# EAGLE design 555timers_with_allmodes (EAGLE 9.6.2)
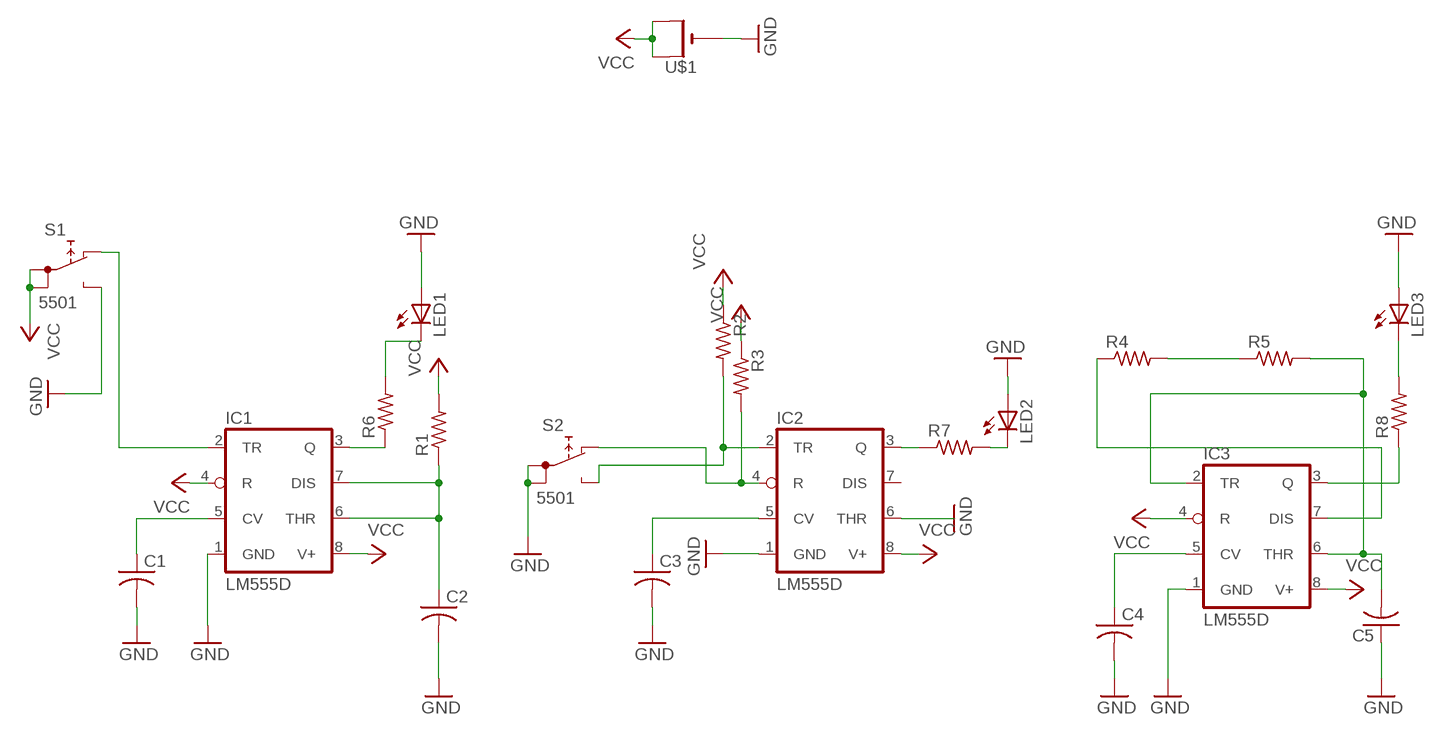
[diagram p0: schematic, sheet 1]

## Parts
C1  C-USC0805  [C0805]
C2  C-USC0805  [C0805]
C3  C-USC0805  [C0805]
C4  C-USC0805  [C0805]
C5  C-USC0805  [C0805]
IC1  LM555D  [SO08]
IC2  LM555D  [SO08]
IC3  LM555D  [SO08]
LED1  LEDCHIPLED_0805  [CHIPLED_0805]
LED2  LEDCHIPLED_0805  [CHIPLED_0805]
LED3  LEDCHIPLED_0805  [CHIPLED_0805]
R1  R-US_FLIPFLOP  [0805-THM]
R2  R-US_FLIPFLOP  [0805-THM]
R3  R-US_FLIPFLOP  [0805-THM]
R4  R-US_FLIPFLOP  [0805-THM]
R5  R-US_FLIPFLOP  [0805-THM]
R6  R-US_FLIPFLOP  [0805-THM]
R7  R-US_FLIPFLOP  [0805-THM]
R8  R-US_FLIPFLOP  [0805-THM]
S1  5501  [5501]
S2  5501  [5501]
U$1  CR1220SMT  [CR1220-SMD]

## Nets
GND: C1.2 C2.2 C3.2 C4.2 C5.1 IC1.1(GND) IC2.1(GND) IC2.6(THR) IC3.1(GND) LED1.A LED2.A LED3.A S1.NO S2.1A S2.1B U$1.-
N$1: C1.1 IC1.5(CV)
N$2: IC2.2(TR) R2.2 S2.NO
N$3: C2.1 IC1.6(THR) IC1.7(DIS) R1.1
N$5: IC1.2(TR) S1.NC
N$6: LED1.C R6.2
N$7: C3.1 IC2.5(CV)
N$8: IC2.4(R) R3.2 S2.NC
N$9: C4.1 IC3.5(CV)
N$11: IC2.3(Q) R7.1
N$13: C5.2 IC3.2(TR) IC3.6(THR) R5.2
N$14: R4.2 R5.1
N$15: IC1.3(Q) R6.1
N$16: IC3.7(DIS) R4.1
N$17: IC3.3(Q) R8.1
N$18: LED2.C R7.2
N$19: LED3.C R8.2
VCC: IC1.4(R) IC1.8(V+) IC2.8(V+) IC3.4(R) IC3.8(V+) R1.2 R2.1 R3.1 S1.1A S1.1B U$1.+$1(+) U$1.+$2(+1)
Unconnected: IC2.7(DIS)

## Library data of the parts
C1-C5 = adafruit:C-US: CAPACITOR, American symbol
IC1-IC3 = adafruit:*555: TIMER Changed DIP package to have round (not oval) pin pads http://www.ladyada.net/library/pcb/eaglelibrary.html
LED1-LED3 = adafruit:LED: LED OSRAM: - CHIPLED LG R971, LG N971, LY N971, LG Q971, LY Q971, LO R971, LY R971 LH N974, LH R974 LS Q976, LO Q976, LY Q976 LO Q996 - Hyper CHIPLED LW Q18S LB Q993, LB Q99A, LB R99A - SideLED LS A670, LO A670, LY A670, LG A670, LP A670 LB A673, LV A673, LT A673, LW A673 LH A674 LY A675 LS A676, LA A676, LO A676, LY A676, LW A676 LS A679, LY A679, LG A679 - Hyper Micro SIDELED® LS Y876, LA Y876, LO Y876, LY Y876 LT Y87S - SmartLED LW L88C, LW L88S LB L89C, LB L89S, LG L890 LS L89K, LO L89K, LY L89K LS L896, LA L896, LO L896, LY L896 - TOPLED LS T670, LO T670, LY T670, LG T670, LP T670 LSG T670, LSP T670, LSY T670, LOP T670, LYG T670 LG T671, LOG T671, LSG T671 LB T673, LV T673, LT T673, LW T673 LH T674 LS T676, LA T676, LO T676, LY T676, LB T676, LH T676, LSB T676, LW T676 LB T67C, LV T67C, LT T67C, LS T67K, LO T67K, LY T67K, LW E67C LS E67B, LA E67B, LO E67B, LY E67B, LB E67C, LV E67C, LT E67C LW T67C LS T679, LY T679, LG T679 LS T770, LO T770, LY T770, LG T770, LP T770 LB T773, LV T773, LT T773, LW T773 LH T774 LS E675, LA E675, LY E675, LS T675 LS T776, LA T776, LO T776, LY T776, LB T776 LHGB T686 LT T68C, LB T68C - Hyper Mini TOPLED® LB M676 - Mini TOPLED Santana® LG M470 LS M47K, LO M47K, LY M47K Source: http://www.osram.convergy.de/
R1-R8 = adafruit:R-US_: RESISTOR, American symbol
S1 S2 = switch:55?: PUSHBUTTON SERIES 5500 SWITCHES Source: www.e-switch.com .. 5500.pdf
U$1 = adafruit:CR1220: CR1216/CR1220/CR1225 12mm 3V lithium coin cell Great for battery packup. Both SMT and THM holders. Note the THM package has the ground pads on both sides of the PCB so that the masks are the same - this reduces the cost

## Net classes
0 default: width 0.305 mm, drill 0.508 mm, clearance 0.254 mm

## Board
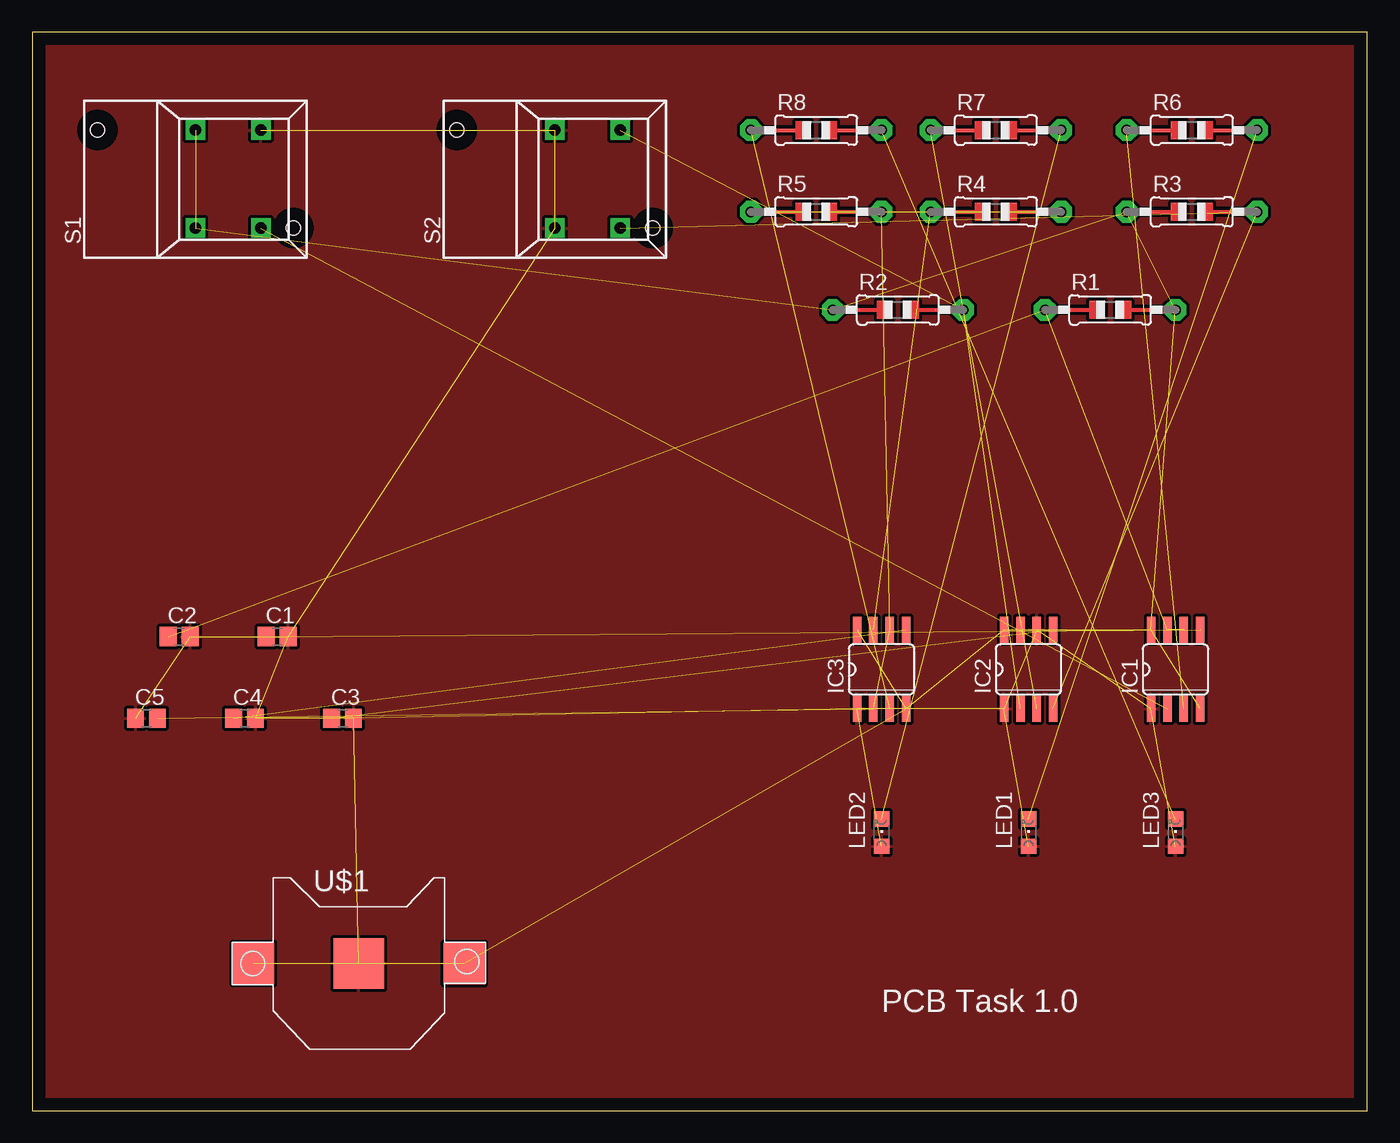
[diagram p1: board, top side]

Size 103.81 x 83.81 mm. Coordinates in mm from the lower left corner, seen from the top.
Outline: 0,0 103.81,0 103.81,83.81 0,83.81 0,0
Copper layers (1*16): Top 0.035mm / dielectric 1.5mm / Bottom 0.035mm
Design rules "default": minimum track width 6mil, minimum drill 0.35mm, track to track 6mil, track to pad 6mil, pad to pad 6mil, via to via 6mil, smd to smd 6mil, copper to edge 40mil, drill to drill 6mil, minimum pad ring 10mil, minimum via ring 8mil, stop-mask expansion 4mil, vias tented up to drill 0mil, thermal gap 10mil

### Footprints (pad centres in the part's own frame; a part is rotated, then mirrored left to right if it is on the bottom)
C0805 = smd 1.3 x 1.5: 1 -0.85,0; 2 0.85,0
SO08 = smd 0.66 x 2.032: 1 -1.905,-3.073; 2 -0.635,-3.073; 3 0.635,-3.073; 4 1.905,-3.073; 5 1.905,3.073; 6 0.635,3.073; 7 -0.635,3.073; 8 -1.905,3.073
CHIPLED_0805 = smd 1.2 x 1.2: A 0,-1.05; C 0,1.05
0805-THM = drill 0.813 pad 1.676 octagon: 1 -5.08,0; 2 5.08,0
5501 = drill 0.9 pad 1.5 square: 1A 0,3.81; 1B 0,-3.81; NC 5.08,-3.81; NO 5.08,3.81 | hole 1.1: -7.62,3.81; 7.62,-3.81
CR1220-SMD = smd 3.2 x 3.2: +$1 -8.2,0; +$2 8.2,0 | smd 3.9 x 3.9: - 0,0

### Placement (x,y rotation side)
C1  19.05,36.83 0 top
C2  11.43,36.83 0 top
C3  24.13,30.48 0 top
C4  16.51,30.48 0 top
C5  8.89,30.48 0 top
IC1  88.9,34.29 0 top
IC2  77.47,34.29 0 top
IC3  66.04,34.29 0 top
LED1  77.47,21.59 0 top
LED2  66.04,21.59 0 top
LED3  88.9,21.59 0 top
R1  83.82,62.23 0 top
R2  67.31,62.23 0 top
R3  90.17,69.85 0 top
R4  74.93,69.85 0 top
R5  60.96,69.85 0 top
R6  90.17,76.2 0 top
R7  74.93,76.2 0 top
R8  60.96,76.2 0 top
S1  12.7,72.39 0 top
S2  40.64,72.39 0 top
U$1  25.4,11.43 0 top

### Tracks (layer width: path | path; a pad name or v marks a point on that pad's centre or on a via)
GND  (15 unrouted)
  pour Top: -1.27,85.09 -1.27,-2.54 105.41,-2.54 105.41,85.09
N$1  (1 unrouted)
N$2  (2 unrouted)
N$3  (3 unrouted)
N$5  (1 unrouted)
N$6  (1 unrouted)
N$7  (1 unrouted)
N$8  (2 unrouted)
N$9  (1 unrouted)
N$11  (1 unrouted)
N$13  (3 unrouted)
N$14  (1 unrouted)
N$15  (1 unrouted)
N$16  (1 unrouted)
N$17  (1 unrouted)
N$18  (1 unrouted)
N$19  (1 unrouted)
VCC  (11 unrouted)

### Text on the board
tNames: PCB Task 1.0